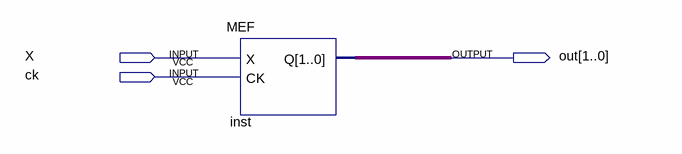
[diagram p0: schematic sheet]
// Quartus schematic ISDSim2.bdf as structural Verilog: 1 symbols, 3 pins
module ISDSim2 (
  input  X,
  input  ck,
  output [1:0] out
);

  MEF inst (.X(X), .CK(ck), .Q(out));
endmodule
